# Altium schematic sheet AIM2 - UART LEDS REVB.SchDoc
size B; DrawnBy: DJW; DocumentNumber: 5; SheetNumber: 5; SheetTotal: 12
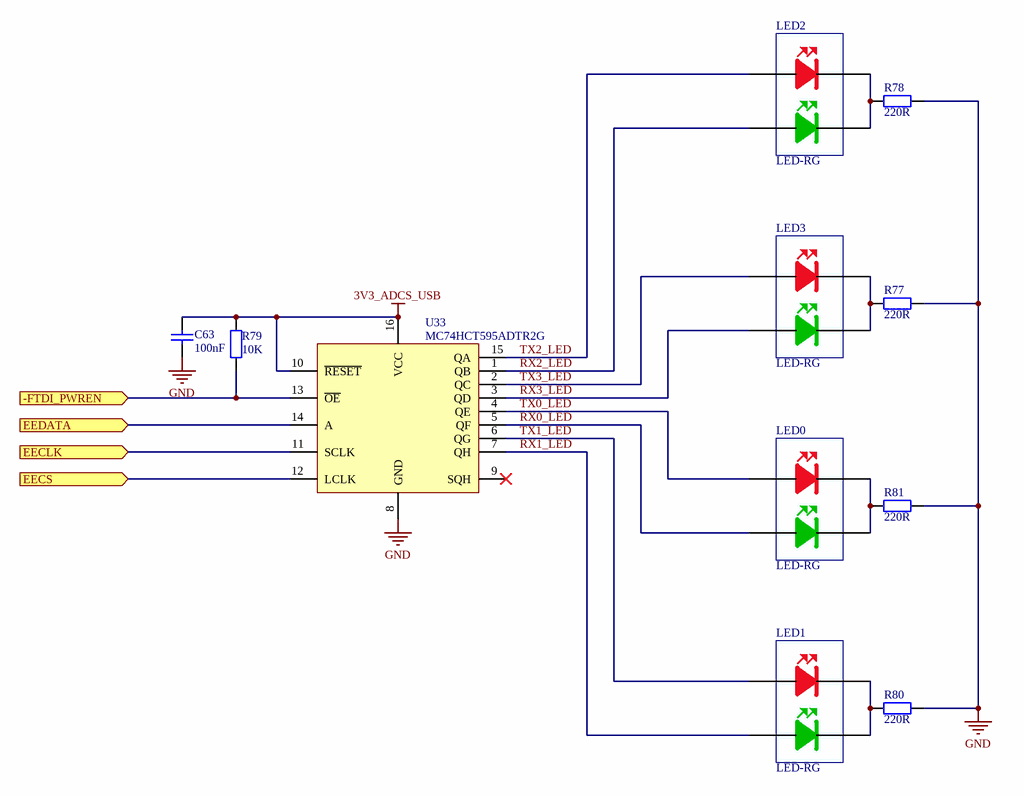
[diagram p0: AIM2 - UART LEDS REVB.SchDoc]

## Parts
C63  100nF  [0603 CAP]
LED0  LED-RG  [LED SMT RG]
LED1  LED-RG  [LED SMT RG]
LED2  LED-RG  [LED SMT RG]
LED3  LED-RG  [LED SMT RG]
R77  220R  [0805 RES]
R78  220R  [0805 RES]
R79  10K  [0805 RES]
R80  220R  [0805 RES]
R81  220R  [0805 RES]
U33  MC74HCT595ADTR2G  [TSOP-16]

## Ports
-FTDI_PWREN (in), EECLK (in), EECS (in), EEDATA (in)

## Nets
3V3_ADCS_USB: C63.2 R79.2 U33.10(~{RESET}) U33.16(VCC)
GND: C63.1 R77.2 R78.2 R80.2 R81.2 U33.8(GND)
-FTDI_PWREN: R79.1 U33.13(~{OE}) ; port -FTDI_PWREN
EECLK: U33.11(SCLK) ; port EECLK
EECS: U33.12(LCLK) ; port EECS
EEDATA: U33.14(A) ; port EEDATA
RX0_LED: LED0.4 U33.5(QF)
RX1_LED: LED1.4 U33.7(QH)
RX2_LED: LED2.4 U33.1(QB)
RX3_LED: LED3.4 U33.3(QD)
TX0_LED: LED0.1 U33.4(QE)
TX1_LED: LED1.1 U33.6(QG)
TX2_LED: LED2.1 U33.15(QA)
TX3_LED: LED3.1 U33.2(QC)
NetLED0_2: LED0.2 LED0.3 R81.1
NetLED1_2: LED1.2 LED1.3 R80.1
NetLED2_2: LED2.2 LED2.3 R78.1
NetLED3_2: LED3.2 LED3.3 R77.1

Not connected (* = marked no-connect by the designer): U33 9(SQH)*

## Notes on the sheet
- Title:
- 750 Naples Street
- San Francisco, California  94112
- Doc. Rev: 01
- File:
- Part Number:
- Revision:
- Sheet:
- (C) 2001-2017 Pumpkin, Inc.
- Date:
- Size:
- B
- Drawn By:

## Library data of the parts
C63 = Capacitor 100nF 0603: Capacitor 100nF 0603 X7R 50V 5%; Value: 100nF; Supplier 1: Digi-Key; Supplier Part Number 1: 399-7844-1-ND
LED0-LED3 = LED RED/GREEN 0805: LED Red, Green 0805; Supplier 1: Digi-Key; Supplier Part Number 1: 754-1093-1-ND
R77 R78 R80 R81 = Resistor 220R 0805: Resistor 220R 0805 0.125W 1%; Revision: Altium ETH 11-03.2008; Value: 220R; Supplier 1: Digi-Key; Supplier Part Number 1: P220CCT-ND
R79 = Resistor 10K 0805: Resistor 10K 0805 0.125W 1%; Revision: Altium ETH 11-03.2008; Supplier 1: Digi-Key; Supplier Part Number 1: 311-10.0KCRCT-ND; Value: 10K
U33 = MC74HCT595ADTR2G: IC Shift Register; Supplier 1: Digi-Key; Supplier Part Number 1: MC74HCT595ADTR2GOSCT-ND